# Altium schematic sheet Sheet1.SchDoc (part 1 of 3)
size Letter; Organization: Cegep Limoilou; Address1: 1300, 8e Avenue; Address2: Québec, QC; Address3: Canada; Address4: G1J 5L5; Revision: Révision?; SheetNumber: ?; SheetTotal: ?; Conception: Conception?; Titre: Titre?; Modification: Modification?
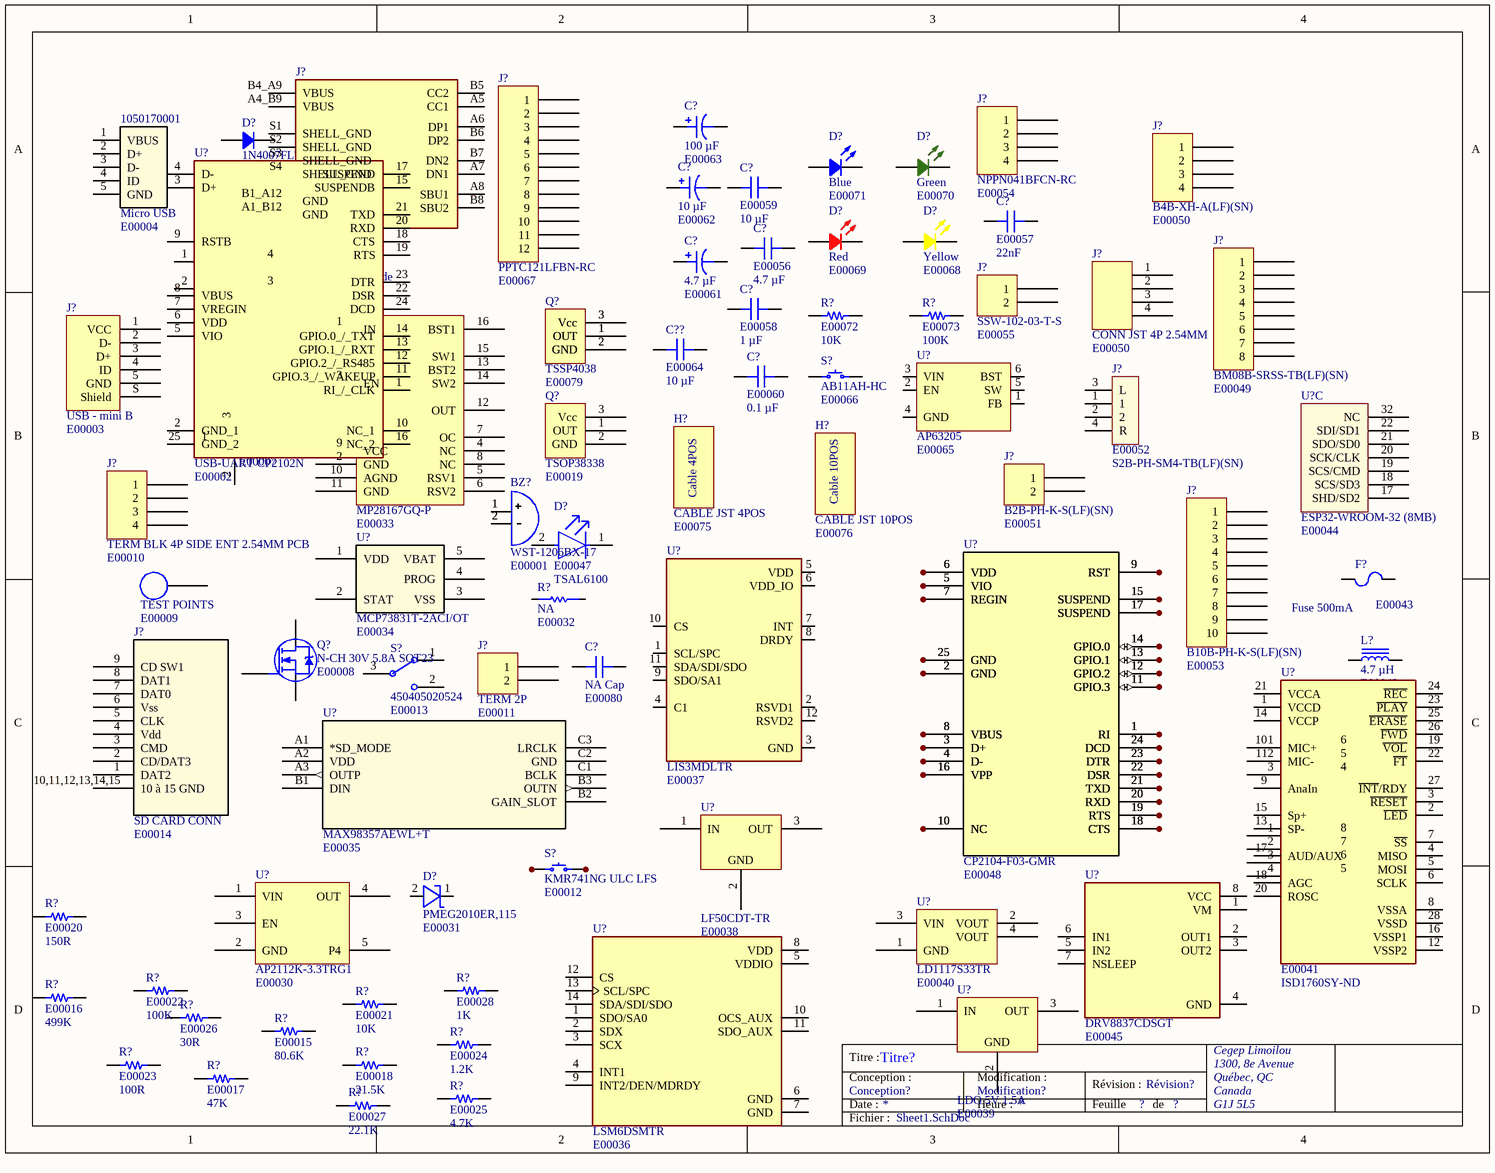
[diagram p0: Sheet1.SchDoc]

## Parts
(Parts that share a designator on the sheet are numbered #1, #2 ... from top to bottom, then left to right.)
1050170001  Micro USB  ADAM Inventory Number 1: E00004  [CONN_1050170001_MOL]
BZ?  WST-1206BX-17  ADAM Inventory Number 1: E00001  [BUZZ WST-1206BX]
C?#1  100 µF  ADAM Inventory Number 1: E00063  [CAP ALSMD ELEC 8.3MM H10.5MM]
C?#2  10 µF  ADAM Inventory Number 1: E00062  [CAP ALUM 4.3MM2]
C?#3  ADAM Inventory Number 1: E00059  [CAP 0603]  (hidden comment: 10 µF)
C?#4  ADAM Inventory Number 1: E00057  [CAP 0603]  (hidden comment: 22nF)
C?#5  ADAM Inventory Number 1: E00056  [CAP 0603]  (hidden comment: 4.7 µF)
C?#6  4.7 µF  ADAM Inventory Number 1: E00061  [CAP ALUM 4.3MM2]
C?#7  ADAM Inventory Number 1: E00058  [CAP 0603]  (hidden comment: 1 µF)
C?#8  ADAM Inventory Number 1: E00060  [CAP 0603]  (hidden comment: 0.1 µF)
C?#9  NA Cap  ADAM Inventory Number 1: E00080  [CAP 0603]
C??  ADAM Inventory Number 1: E00064  [CAP 0603]  (hidden comment: 10 µF)
D?#1  1N4007FLTR  ADAM Inventory Number 1: E00029  [SOD123F]
D?#2  Blue  ADAM Inventory Number 1: E00071  [Blue LED 0603]
D?#3  Green  ADAM Inventory Number 1: E00070  [Green LED 0603]
D?#4  Red  ADAM Inventory Number 1: E00069  [Red Led 0603]
D?#5  Yellow  ADAM Inventory Number 1: E00068  [YELLOW LED 0603 - duplicate]
D?#6  TVS Diode  [TVS DIODE]
D?#7  TVS Diode 5.5V  ADAM Inventory Number 1: E00006  [TVS 5.5 DIODE]
D?#8  ADAM Inventory Number 1: E00047  [IR TRANSMITTER]  (hidden comment: TSAL6100)
D?#9  PMEG2010ER,115  ADAM Inventory Number 1: E00031  [DIODE_PMEG2010ER,115_NEX]
F?  Fuse 500mA  ADAM Inventory Number 1: E00043  [Fuse 500mA 0.6mm]
H?#1  CABLE JST 10POS  ADAM Inventory Number 1: E00076
H?#2  CABLE JST 4POS  ADAM Inventory Number 1: E00075
J?#1  NPPN041BFCN-RC  ADAM Inventory Number 1: E00054  [CONN FEM HEADER 4PIN]
J?#2  PPTC121LFBN-RC  ADAM Inventory Number 1: E00067  [CONN 12PIN FEMALE]
J?#3  B4B-XH-A(LF)(SN)  ADAM Inventory Number 1: E00050  [CONN JST 4PIN]
J?#4  USB4105-GF-A  ADAM Inventory Number 1: E00005  [USB C HORIZONTAL]
J?#5  SSW-102-03-T-S  ADAM Inventory Number 1: E00055  [CONN FEM HEADER 2PIN]
J?#6  CONN JST 4P 2.54MM  ADAM Inventory Number 1: E00050  [MOLEX KK 0022272041]
J?#7  BM08B-SRSS-TB(LF)(SN)  ADAM Inventory Number 1: E00049  [JST BM08B-SRSS]
J?#8  USB - mini B  ADAM Inventory Number 1: E00003  [USB B Horizontal]
J?#9  ADAM Inventory Number 1: E00052  Supplier Part Number 1: S2B-PH-SM4-TB(LF)(SN)  [S2B-PH-SM4-TB_LF__SN]  (hidden comment: CONN JST 2P SM 90DEG)
J?#10  B2B-PH-K-S(LF)(SN)  ADAM Inventory Number 1: E00051  [CONN JST 2PIN]
J?#11  TERM BLK 4P SIDE ENT 2.54MM PCB  ADAM Inventory Number 1: E00010  [TERM BLOC 4P]
J?#12  B10B-PH-K-S(LF)(SN)  ADAM Inventory Number 1: E00053  [CONN JST 10PIN]
J?#13  SD CARD CONN  ADAM Inventory Number 1: E00014  [CONN9_020811_WRE]
J?#14  TERM 2P  ADAM Inventory Number 1: E00011  [TERM BLOC 2P]
L?  4.7 µH  ADAM Inventory Number 1: E00042  [IND 4.7UH 4.6A]
Q?#1  TSSP4038  ADAM Inventory Number 1: E00079  [IR Receptor]
Q?#2  MMBT2222AM3T5G  ADAM Inventory Number 1: E00007  [SOT-723]
Q?#3  TSOP38338  ADAM Inventory Number 1: E00019  [IR Receptor]
Q?#4  N-CH 30V 5.8A SOT23  ADAM Inventory Number 1: E00008  [N-CHANNEL TRANS]
R?#1  ADAM Inventory Number 1: E00072  [RES 0603]  (hidden comment: 10K)
R?#2  ADAM Inventory Number 1: E00073  [RES 0603]  (hidden comment: 100K)
R?#3  NA  ADAM Inventory Number 1: E00032  [RES 0603]
R?#4  ADAM Inventory Number 1: E00020  [RES 0603]  (hidden comment: 150R)
R?#5  ADAM Inventory Number 1: E00022  [RES 0603]  (hidden comment: 100K)
R?#6  ADAM Inventory Number 1: E00028  [RES 0603]  (hidden comment: 1K)
R?#7  ADAM Inventory Number 1: E00016  [RES 0603]  (hidden comment: 499K)
R?#8  ADAM Inventory Number 1: E00021  [RES 0603]  (hidden comment: 10K)
R?#9  ADAM Inventory Number 1: E00026  [RES 0603]  (hidden comment: 30R)
R?#10  ADAM Inventory Number 1: E00015  [RES 0603]  (hidden comment: 80.6K)
R?#11  ADAM Inventory Number 1: E00024  [RES 0603]  (hidden comment: 1.2K)
R?#12  ADAM Inventory Number 1: E00023  [RES 0603]  (hidden comment: 100R)
R?#13  ADAM Inventory Number 1: E00018  [RES 0603]  (hidden comment: 21.5K)
R?#14  ADAM Inventory Number 1: E00017  [RES 0603]  (hidden comment: 47K)
R?#15  ADAM Inventory Number 1: E00025  [RES 0603]  (hidden comment: 4.7K)
R?#16  ADAM Inventory Number 1: E00027  [RES 0603]  (hidden comment: 22.1K)
S?#1  AB11AH-HC  ADAM Inventory Number 1: E00066  [BUTTON AB11AH-HC]
S?#2  450405020524  ADAM Inventory Number 1: E00013  [SL 3Pos Switch]
S?#3  Dip Switch 3P  ADAM Inventory Number 1: E00009  [DIPSWITCH SMD 3P]
S?#4  KMR741NG ULC LFS  ADAM Inventory Number 1: E00012  [Switch Lin SMD]
S?#5  Dip Switch 4P  ADAM Inventory Number 1: E00046  [Dip Switch SMD]
T?  TEST POINTS  ADAM Inventory Number 1: E00009  [TEST POINTS]
U?#1  AP63205  ADAM Inventory Number 1: E00065  [AP63205]
U?#2  MP28167GQ-P  ADAM Inventory Number 1: E00033  [MP2816GQ-P]
U?#3  USB-UART CP2102N  ADAM Inventory Number 1: E00002  [CP2102N-USB-UART]
U?#4  ESP32-WROOM-32 (8MB)  ADAM Inventory Number 1: E00044  [ESP32-WROOM-32D]  (part C of 3)
U?#5  MCP73831T-2ACI/OT  ADAM Inventory Number 1: E00034  [SOT23_MCP73831T-2ACI/OT_HNW]
U?#6  LIS3MDLTR  ADAM Inventory Number 1: E00037  [XDCR_LIS3MDLTR]
U?#7  CP2104-F03-GMR  ADAM Inventory Number 1: E00048  [QFN_F03-GMR_SIL-M]
U?#8  ADAM Inventory Number 1: E00041  Supplier Part Number 1: ISD1760SY-ND  [ISD1760SY]  (hidden comment: ISD1760SY)
U?#9  MAX98357AEWL+T  ADAM Inventory Number 1: E00035  [21-0896B_9_MXM]
U?#10  LF50CDT-TR  ADAM Inventory Number 1: E00038  [LDO 5V]
U?#11  AP2112K-3.3TRG1  ADAM Inventory Number 1: E00030
U?#12  LD1117S33TR  ADAM Inventory Number 1: E00040  [SOT-223]
U?#13  DRV8837CDSGT  ADAM Inventory Number 1: E00045  [DRV8837CDSGT]
U?#14  LSM6DSMTR  ADAM Inventory Number 1: E00036  [PQFN50P300X250X86-14N]
U?#15  LDO 5V 1.5A  ADAM Inventory Number 1: E00039  [LDO 5V 1.5A]

## Nets
NetS?#4_1: S?#4.1 S?#4.2
NetS?#4_3: S?#4.3 S?#4.4

Not connected (* = marked no-connect by the designer): 1050170001 1(VBUS) 2(D+) 3(D-) 4(ID) 5(GND); BZ? 1 2; C?#1 1 2; C?#2 1 2; C?#3 1 2; C?#4 1 2; C?#5 1 2; C?#6 1 2; C?#7 1 2; C?#8 1 2; C?#9 1 2; C?? 1 2; D?#1 1 2; D?#2 1 2; D?#3 1 2; D?#4 1 2; D?#5 1 2; D?#6 1 2; D?#7 1 2 3 4; D?#8 1(C) 2(A); D?#9 1(K) 2(A); F? 1 2; J?#1 1 2 3 4; J?#2 1 2 3 4 5 6 7 8 9 10 11 12; J?#3 1 2 3 4; J?#4 A1_B12(GND) A4_B9(VBUS) A5(CC1) A6(DP1) A7(DN1) A8(SBU1) B1_A12(GND) B4_A9(VBUS) B5(CC2) B6(DP2) B7(DN2) B8(SBU2) S1(SHELL_GND) S2(SHELL_GND) S3(SHELL_GND) S4(SHELL_GND); J?#5 1 2; J?#6 1 2 3 4; J?#7 1 2 3 4 5 6 7 8; J?#8 1(VCC) 2(D-) 3(D+) 4(ID) 5(GND) S(Shield); J?#9 1 2 3(L) 4(R); J?#10 1 2; J?#11 1 2 3 4; J?#12 1 2 3 4 5 6 7 8 9 10; J?#13 1(DAT2) 2(CD/DAT3) 3(CMD) 4(Vdd) 5(CLK) 6(Vss) 7(DAT0) 8(DAT1) 9(CD_SW1) 10,11,12,13,14,15(10_à_15_GND); J?#14 1 2; L? 1 2; Q?#1 1(OUT) 2(GND) 3(Vcc); Q?#2 1(B) 2(E) 3(C); Q?#3 1(OUT) 2(GND) 3(Vcc); Q?#4 1(G) 2(S) 3(D); R?#1 1 2; R?#2 1 2; R?#3 1 2; R?#4 1 2; R?#5 1 2; R?#6 1 2; R?#7 1 2; R?#8 1 2; R?#9 1 2; R?#10 1 2; R?#11 1 2; R?#12 1 2; R?#13 1 2; R?#14 1 2; R?#15 1 2; R?#16 1 2; S?#1 1 2; S?#2 1 2 3(COM); S?#3 1 2 3 4 5 6; S?#5 1 2 3 4 5 6 7 8; T? 1; U?#1 1(FB) 2(EN) 3(VIN) 4(GND) 5(SW) 6(BST); U?#2 1(IN) 2(GND) 3(EN) 4(NC) 5(RSV1) 6(RSV2) 7(OC) 8(NC) 9(VCC) 10(AGND) 11(GND) 12(OUT) 13(BST2) 14(SW2) 15(SW1) 16(BST1); U?#3 1(RI_/_CLK) 2(GND_1) 3(D+) 4(D-) 5(VIO) 6(VDD) 7(VREGIN) 8(VBUS) 9(RSTB) 10(NC_1) 11(GPIO.3_/_WAKEUP) 12(GPIO.2_/_RS485) 13(GPIO.1_/_RXT) 14(GPIO.0_/_TXT) 15(SUSPENDB) 16(NC_2) 17(SUSPEND) 18(CTS) 19(RTS) 20(RXD) 21(TXD) 22(DSR) 23(DTR) 24(DCD) 25(GND_2); U?#4 17(SHD/SD2) 18(SCS/SD3) 19(SCS/CMD) 20(SCK/CLK) 21(SDO/SD0) 22(SDI/SD1) 32(NC); U?#5 1(VDD) 2(STAT) 3(VSS) 4(PROG) 5(VBAT); U?#6 1(SCL/SPC) 2(RSVD1) 3(GND) 4(C1) 5(VDD) 6(VDD_IO) 7(INT) 8(DRDY) 9(SDO/SA1) 10(CS) 11(SDA/SDI/SDO) 12(RSVD2); U?#7 1(RI) 2(GND) 3(D+) 4(D-) 5(VIO) 6(VDD) 7(REGIN) 8(VBUS) 9(RST) 10(NC) 11(GPIO.3) 12(GPIO.2) 13(GPIO.1) 14(GPIO.0) 15(SUSPEND) 16(VPP) 17(SUSPEND) 18(CTS) 19(RTS) 20(RXD) 21(TXD) 22(DSR) 23(DTR) 24(DCD) 25(GND); U?#8 1(VCCD) 2(~{LED}) 3(~{RESET}) 4(MISO) 5(MOSI) 6(SCLK) 7(~{SS}) 8(VSSA) 9(AnaIn) 10(MIC+) 11(MIC-) 12(VSSP2) 13(SP-) 14(VCCP) 15(Sp+) 16(VSSP1) 17(AUD/AUX) 18(AGC) 19(~{VOL}) 20(ROSC) 21(VCCA) 22(~{FT}) 23(~{PLAY}) 24(~{REC}) 25(~{ERASE}) 26(~{FWD}) 27(~{INT}/RDY) 28(VSSD); U?#9 A1(*SD_MODE) A2(VDD) A3(OUTP) B1(DIN) B2(GAIN_SLOT) B3(OUTN) C1(BCLK) C2(GND) C3(LRCLK); U?#10 1(IN) 2(GND) 3(OUT); U?#11 1(VIN) 2(GND) 3(EN) 4(OUT) 5(P4); U?#12 1(GND) 2(VOUT) 3(VIN) 4(VOUT); U?#13 1(VM) 2(OUT1) 3(OUT2) 4(GND) 5(IN2) 6(IN1) 7(NSLEEP) 8(VCC); U?#14 1(SDO/SA0) 2(SDX) 3(SCX) 4(INT1) 5(VDDIO) 6(GND) 7(GND) 8(VDD) 9(INT2/DEN/MDRDY) 10(OCS_AUX) 11(SDO_AUX) 12(CS) 13(SCL/SPC) 14(SDA/SDI/SDO); U?#15 1(IN) 2(GND) 3(OUT)

## Notes on the sheet
- Titre :
- Conception :
- Date :
- Modification :
- Heure :
- Révision :
- Feuille
- de
- Fichier :
- (in symbol CABLE JST 4POS NOFP) Cable 4POS
- (in symbol CABLE JST 10POS NOFP) Cable 10POS